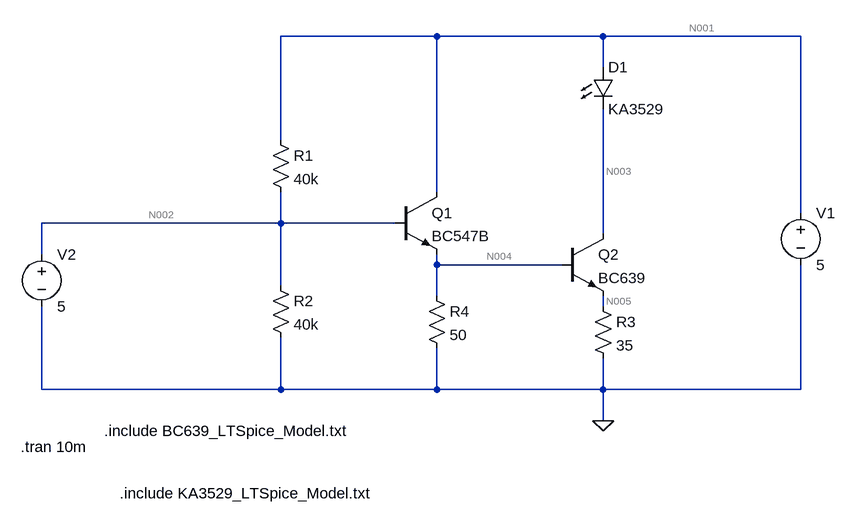
[diagram p0: schematic led driver.asc]
led driver.asc, the LTspice schematic file:
Version 4
SHEET 1 968 680
WIRE 352 -208 112 -208
WIRE 608 -208 352 -208
WIRE 912 -208 608 -208
WIRE 608 -160 608 -208
WIRE 112 -48 112 -208
WIRE 352 32 352 -208
WIRE 912 64 912 -208
WIRE 112 80 112 32
WIRE 112 80 -256 80
WIRE 288 80 112 80
WIRE 608 96 608 -96
WIRE -256 128 -256 80
WIRE 352 144 352 128
WIRE 544 144 352 144
WIRE 112 176 112 80
WIRE 352 192 352 144
WIRE 608 208 608 192
WIRE -256 336 -256 208
WIRE 112 336 112 256
WIRE 112 336 -256 336
WIRE 352 336 352 272
WIRE 352 336 112 336
WIRE 608 336 608 288
WIRE 608 336 352 336
WIRE 912 336 912 144
WIRE 912 336 608 336
WIRE 608 384 608 336
FLAG 608 384 0
SYMBOL voltage 912 48 R0
WINDOW 123 0 0 Left 0
WINDOW 39 0 0 Left 0
SYMATTR InstName V1
SYMATTR Value 5
SYMBOL res 96 -64 R0
SYMATTR InstName R1
SYMATTR Value 40k
SYMBOL res 96 160 R0
SYMATTR InstName R2
SYMATTR Value 40k
SYMBOL npn2 288 32 R0
SYMATTR InstName Q1
SYMATTR Value BC547B
SYMBOL npn 544 96 R0
SYMATTR InstName Q2
SYMATTR Value BC639
SYMBOL res 592 192 R0
SYMATTR InstName R3
SYMATTR Value 35
SYMBOL res 336 176 R0
SYMATTR InstName R4
SYMATTR Value 50
SYMBOL LED 592 -160 R0
SYMATTR InstName D1
SYMATTR Value KA3529
SYMBOL voltage -256 112 R0
WINDOW 123 0 0 Left 0
WINDOW 39 0 0 Left 0
SYMATTR InstName V2
SYMATTR Value 5
TEXT -160 400 Left 2 !.include BC639_LTSpice_Model.txt
TEXT -288 424 Left 2 !.tran 10m
TEXT -136 496 Left 2 !.include KA3529_LTSpice_Model.txt

The netlist it stands for:
* led driver.asc
V1 N001 0 5
R1 N001 N002 40k
R2 N002 0 40k
Q1 N001 N002 N004 0 BC547B
Q2 N003 N004 N005 0 BC639
R3 N005 0 35
R4 N004 0 50
D1 N001 N003 KA3529
V2 N002 0 5
.model D D
.lib standard.dio
.model NPN NPN
.model PNP PNP
.lib standard.bjt
.include BC639_LTSpice_Model.txt
.tran 10m
.include KA3529_LTSpice_Model.txt
.backanno
.end

* Results of the author's LTspice run, read from the files saved beside the schematic
* Operating Point, zero values left out:
*   V(n001) = 5 V
*   V(n002) = 5 V
*   V(n004) = 4.136 V
*   V(n003) = 3.01 V
*   V(n005) = 3.025 V
*   Ic(Q2) = 14.32 mA
*   Ib(Q2) = 72.09 mA
*   Ie(Q2) = -86.44 mA
*   Ic(Q1) = 153.7 mA
*   Ib(Q1) = 1.173 mA
*   Ie(Q1) = -154.8 mA
*   I(D1) = 14.32 mA
*   I(R4) = 82.73 mA
*   I(R3) = 86.44 mA
*   I(R2) = 125 µA
*   I(V2) = -1.298 mA
*   I(V1) = -168 mA